# EAGLE design ffcbreakout (EAGLE 9.6.2)
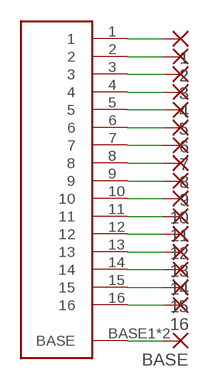
[diagram p0: schematic, sheet 1]

## Parts
1  1,6/0,8  [1,6/0,8]
2  1,6/0,8  [1,6/0,8]
3  1,6/0,8  [1,6/0,8]
4  1,6/0,8  [1,6/0,8]
5  1,6/0,8  [1,6/0,8]
6  1,6/0,8  [1,6/0,8]
7  1,6/0,8  [1,6/0,8]
8  1,6/0,8  [1,6/0,8]
9  1,6/0,8  [1,6/0,8]
10  1,6/0,8  [1,6/0,8]
11  1,6/0,8  [1,6/0,8]
12  1,6/0,8  [1,6/0,8]
13  1,6/0,8  [1,6/0,8]
14  1,6/0,8  [1,6/0,8]
15  1,6/0,8  [1,6/0,8]
16  1,6/0,8  [1,6/0,8]
BASE  1,6/0,8  [1,6/0,8]
U$1  16PINFFC  [16PINFFC]

## Nets
N$1: 1.1(P) U$1.1
N$2: 2.1(P) U$1.2
N$3: 3.1(P) U$1.3
N$4: 4.1(P) U$1.4
N$5: 5.1(P) U$1.5
N$6: 6.1(P) U$1.6
N$7: 7.1(P) U$1.7
N$8: 8.1(P) U$1.8
N$9: 9.1(P) U$1.9
N$10: 10.1(P) U$1.10
N$11: 11.1(P) U$1.11
N$12: 12.1(P) U$1.12
N$13: 13.1(P) U$1.13
N$14: 14.1(P) U$1.14
N$15: 15.1(P) U$1.15
N$16: 16.1(P) U$1.16
N$17: BASE.1(P) U$1.BASE1(BASE) U$1.BASE2(BASE)

## Library data of the parts
1-16 BASE = wirepad:1,6/0,8: THROUGH-HOLE PAD
U$1 = general:16PINFFC

## Net classes
0 default: width 0.279 mm

## Board
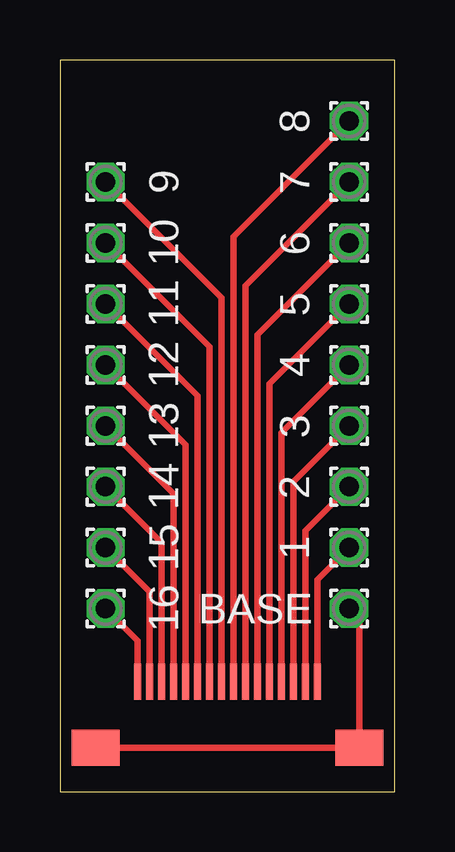
[diagram p1: board, top side]

Size 13.97 x 30.48 mm. Coordinates in mm from the lower left corner, seen from the top.
Outline: 0,0 13.97,0 13.97,30.48 0,30.48 0,0
Copper layers (1*16): Top 0.035mm / dielectric 1.5mm / Bottom 0.035mm
Design rules "default *": minimum track width 6mil, minimum drill 0.35mm, track to track 6mil, track to pad 6mil, pad to pad 6mil, via to via 6mil, smd to smd 6mil, copper to edge 10mil, drill to drill 6mil, minimum pad ring 10mil, minimum via ring 8mil, stop-mask expansion 4mil, vias tented up to drill 0mil, thermal gap 10mil

### Footprints (pad centres in the part's own frame; a part is rotated, then mirrored left to right if it is on the bottom)
1,6/0,8 = drill 0.813 pad 1.6 octagon: 1 0,0
16PINFFC = smd 0.3 x 1.5: 1 -3.75,0; 2 -3.25,0; 3 -2.75,0; 4 -2.25,0; 5 -1.75,0; 6 -1.25,0; 7 -0.75,0; 8 -0.25,0; 9 0.25,0; 10 0.75,0; 11 1.25,0; 12 1.75,0; 13 2.25,0; 14 2.75,0; 15 3.25,0; 16 3.75,0 | smd 2 x 1.5: BASE1 -5.5,2.75; BASE2 5.5,2.75

### Placement (x,y rotation side)
1  12.06,10.16 0 top
2  12.06,12.7 0 top
3  12.06,15.24 0 top
4  12.06,17.78 0 top
5  12.06,20.32 0 top
6  12.06,22.86 0 top
7  12.06,25.4 0 top
8  12.06,27.94 0 top
9  1.91,25.4 0 top
10  1.91,22.86 0 top
11  1.91,20.32 0 top
12  1.91,17.78 0 top
13  1.91,15.24 0 top
14  1.91,12.7 0 top
15  1.91,10.16 0 top
16  1.91,7.62 0 top
BASE  12.06,7.62 0 top
U$1  6.99,4.57 180 top

### Tracks (layer width: path | path; a pad name or v marks a point on that pad's centre or on a via)
N$1
  Top 0.279: U$1.1 10.73,8.83 1.1
N$2
  Top 0.279: U$1.2 10.23,10.87 2.1
N$3
  Top 0.279: U$1.3 9.73,12.91 3.1
N$4
  Top 0.279: U$1.4 9.23,14.95 4.1
N$5
  Top 0.279: U$1.5 8.73,16.99 5.1
N$6
  Top 0.279: U$1.6 8.23,19.03 6.1
N$7
  Top 0.279: U$1.7 7.73,21.07 7.1
N$8
  Top 0.279: U$1.8 7.24,23.11 8.1
N$9
  Top 0.279: U$1.9 6.74,20.57 9.1
N$10
  Top 0.279: U$1.10 6.24,18.53 10.1
N$11
  Top 0.279: U$1.11 5.74,16.49 11.1
N$12
  Top 0.279: U$1.12 5.24,14.45 12.1
N$13
  Top 0.279: U$1.13 4.74,12.41 13.1
N$14
  Top 0.279: U$1.14 4.24,10.37 14.1
N$15
  Top 0.279: U$1.15 3.74,8.33 15.1
N$16
  Top 0.279: U$1.16 3.24,6.29 16.1
N$17
  Top 0.279: U$1.BASE2 U$1.BASE1 12.48,7.2 BASE.1